# EAGLE design SMS with FM to Genesis (EAGLE 6.5.0)
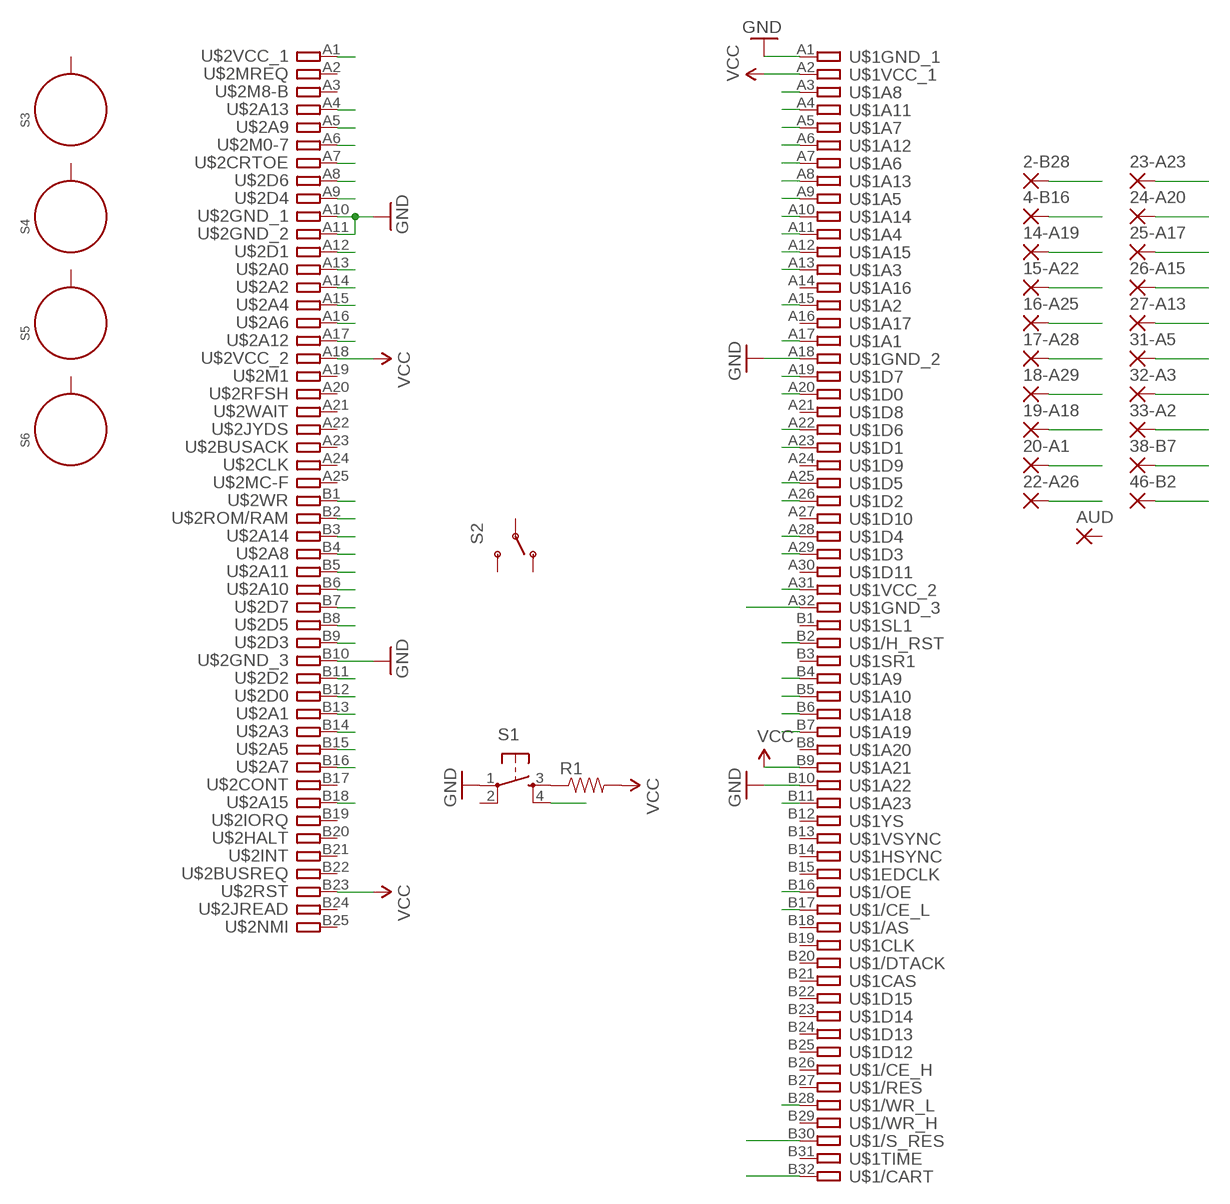
[diagram p0: schematic, sheet 1]

## Parts
2-B28  WIREPADSMD1,27-254  [SMD1,27-2,54]
4-B16  WIREPADSMD1,27-254  [SMD1,27-2,54]
14-A19  WIREPADSMD1,27-254  [SMD1,27-2,54]
15-A22  WIREPADSMD1,27-254  [SMD1,27-2,54]
16-A25  WIREPADSMD1,27-254  [SMD1,27-2,54]
17-A28  WIREPADSMD1,27-254  [SMD1,27-2,54]
18-A29  WIREPADSMD1,27-254  [SMD1,27-2,54]
19-A18  WIREPADSMD1,27-254  [SMD1,27-2,54]
20-A1  WIREPADSMD1,27-254  [SMD1,27-2,54]
22-A26  WIREPADSMD1,27-254  [SMD1,27-2,54]
23-A23  WIREPADSMD1,27-254  [SMD1,27-2,54]
24-A20  WIREPADSMD1,27-254  [SMD1,27-2,54]
25-A17  WIREPADSMD1,27-254  [SMD1,27-2,54]
26-A15  WIREPADSMD1,27-254  [SMD1,27-2,54]
27-A13  WIREPADSMD1,27-254  [SMD1,27-2,54]
31-A5  WIREPADSMD1,27-254  [SMD1,27-2,54]
32-A3  WIREPADSMD1,27-254  [SMD1,27-2,54]
33-A2  WIREPADSMD1,27-254  [SMD1,27-2,54]
38-B7  WIREPADSMD1,27-254  [SMD1,27-2,54]
46-B2  WIREPADSMD1,27-254  [SMD1,27-2,54]
AUD  WIREPADSMD1,27-254  [SMD1,27-2,54]
R1  RESISTOR0805-RES  [0805]
S1  TAC_SWITCHSMD  [TACTILE-SWITCH-SMD]
S2  SWITCH-SPDTPTH  [SWITCH-SPDT]
S3  STANDOFF_ELECTRICAL  [STANDOFF-ELECTRICAL]
S4  STANDOFF_ELECTRICAL  [STANDOFF-ELECTRICAL]
S5  STANDOFF_ELECTRICAL  [STANDOFF-ELECTRICAL]
S6  STANDOFF_ELECTRICAL  [STANDOFF-ELECTRICAL]
U$1  GENESIS-LARGE  [GENESIS-LARGE]
U$2  SMS-R  [SMS]

## Nets
A3: 32-A3.1(P) U$1.A3 U$2.B16
A4: U$1.A4 U$2.B6
A5: 31-A5.1(P) U$1.A5 U$2.A16
A6: U$1.A6 U$2.B5
A7: U$1.A7 U$2.B15
A8: U$1.A8 U$2.A17
A9: U$1.A9 U$2.A15
A10: U$1.A10 U$2.A4
A11: U$1.A11 U$2.B14
A12: U$1.A12 U$2.B3
A13: 27-A13.1(P) U$1.A13 U$2.A14
A15: 26-A15.1(P) U$1.A15 U$2.B13
A17: 25-A17.1(P) U$1.A17 U$2.A13
A19: 14-A19.1(P) U$1.A19 U$2.B7
A20: 24-A20.1(P) U$1.A20 U$2.B12
A22: 15-A22.1(P) U$1.A22 U$2.A8
A23: 23-A23.1(P) U$1.A23 U$2.A12
A25: 16-A25.1(P) U$1.A25 U$2.B8
A26: 22-A26.1(P) U$1.A26 U$2.B11
A28: 17-A28.1(P) U$1.A28 U$2.A9
A29: 18-A29.1(P) U$1.A29 U$2.B9
A31: U$1.A31 U$2.A1
B2: 46-B2.1(P) U$1.B2
B4: U$1.B4 U$2.B4
B5: U$1.B5 U$2.A5
B6: U$1.B6 U$2.A7
B7: 38-B7.1(P) U$1.B7
B11: S1.4 U$1.B11
B16: 4-B16.1(P) U$1.B16 U$2.B2
B17: U$1.B17 U$2.A6 U$2.B18
B28: 2-B28.1(P) U$1.B28 U$2.B1
GND: 19-A18.1(P) 20-A1.1(P) S1.1 U$1.A1 U$1.A18 U$1.B10 U$2.A10 U$2.A11 U$2.B10
N$1: R1.1 S1.3
SMS: U$1.A32 U$1.B30 U$1.B32
VCC: 33-A2.1(P) R1.2 U$1.A2 U$1.B9 U$2.A18 U$2.B23
Unconnected: AUD.1(P) S1.2 S2.1(O) S2.2(P) S2.3(S) S3.P1 S4.P1 S5.P1 S6.P1 U$1.A14 U$1.A16 U$1.A21 U$1.A24 U$1.A27 U$1.A30 U$1.B1 U$1.B3 U$1.B8 U$1.B12 U$1.B13 U$1.B14 U$1.B15 U$1.B18 U$1.B19 U$1.B20 U$1.B21 U$1.B22 U$1.B23 U$1.B24 U$1.B25 U$1.B26 U$1.B27 U$1.B29 U$1.B31 U$2.A2 U$2.A3 U$2.A19 U$2.A20 U$2.A21 U$2.A22 U$2.A23 U$2.A24 U$2.A25 U$2.B17 U$2.B19 U$2.B20 U$2.B21 U$2.B22 U$2.B24 U$2.B25

## Library data of the parts
2-B28 4-B16 14-A19 15-A22 16-A25 17-A28 18-A29 19-A18 20-A1 22-A26 23-A23 24-A20 25-A17 26-A15 27-A13 31-A5 32-A3 33-A2 38-B7 46-B2 AUD = wirepad:WIREPAD: Wire PAD connect wire on PCB
R1 = SparkFun-Passives:RESISTOR: Resistor Basic schematic elements and footprints for 0603, 1206, and PTH resistors.
S1 = SparkFun-Electromechanical:TAC_SWITCH: Momentary Switch Button commonly used for reset or general input. Spark Fun Electronics SKU : COM-00097 SMT- SWCH-08247
S2 = SparkFun-Electromechanical:SWITCH-SPDT: SPDT Switch Simple slide switch, Spark Fun Electronics SKU : COM-00102 DPDT SMT slide switch, AYZ0202, SWCH-08179
S3-S6 = SparkFun-Electromechanical:STANDOFF_ELECTRICAL: A standoff intended to be an electrically connected point. Pad size and stop size allow for a #4 Phillips pan screw head to make a solid connection to the board.
U$1 = genesis:GENESIS: Sega Genesis cartridge connector
U$2 = sms:SMS-R: Sega Master System cartridge connector, reversed

## Board
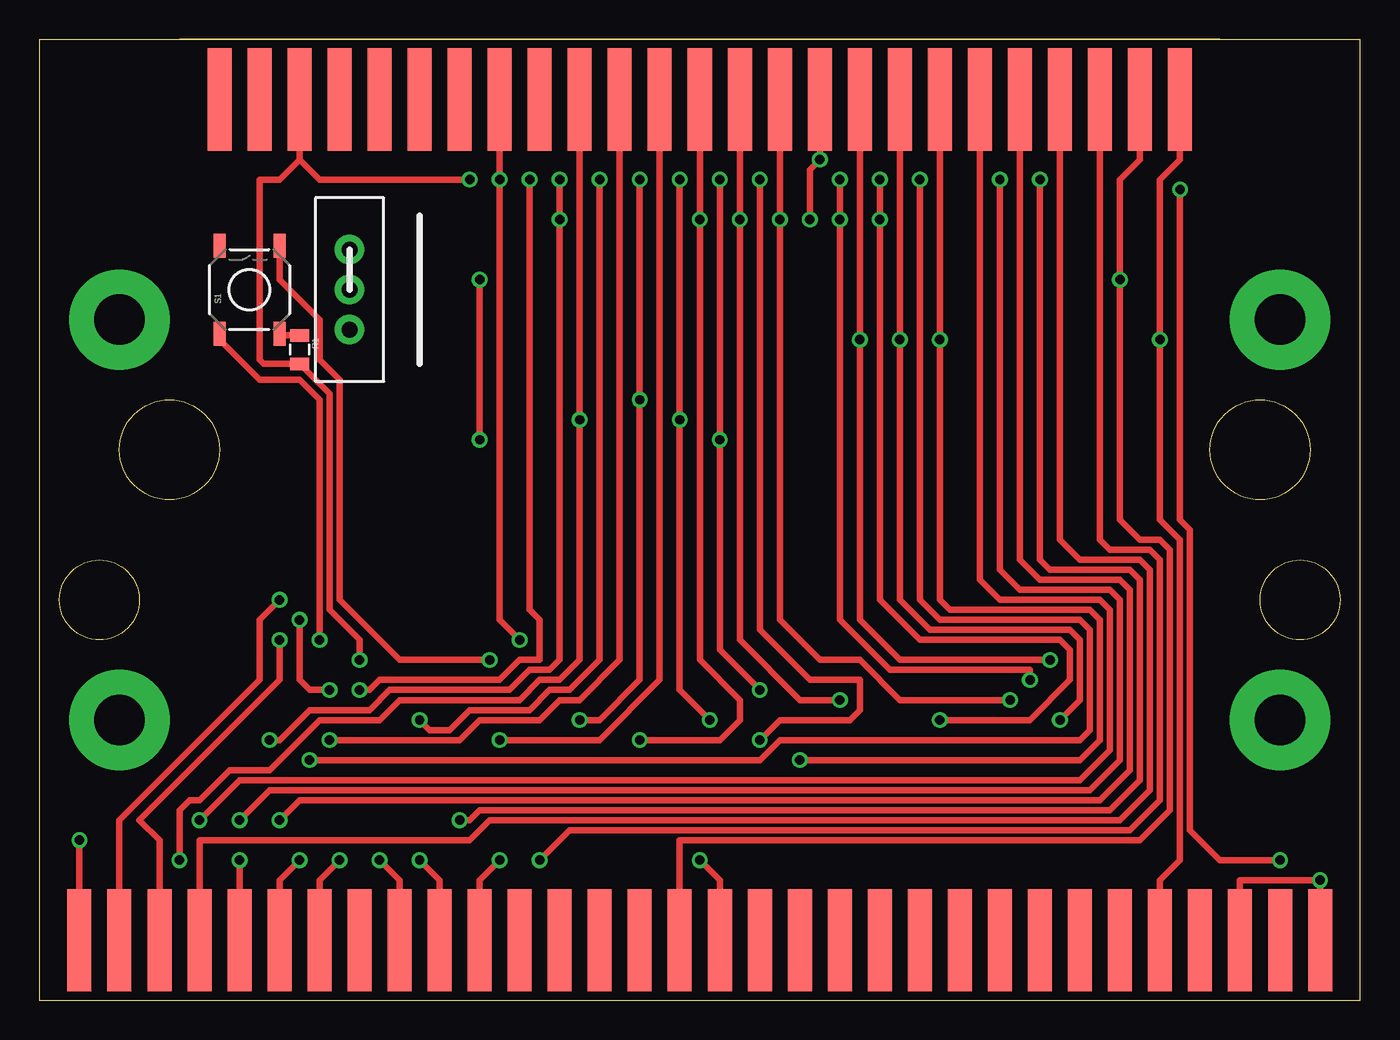
[diagram p1: board, top side]
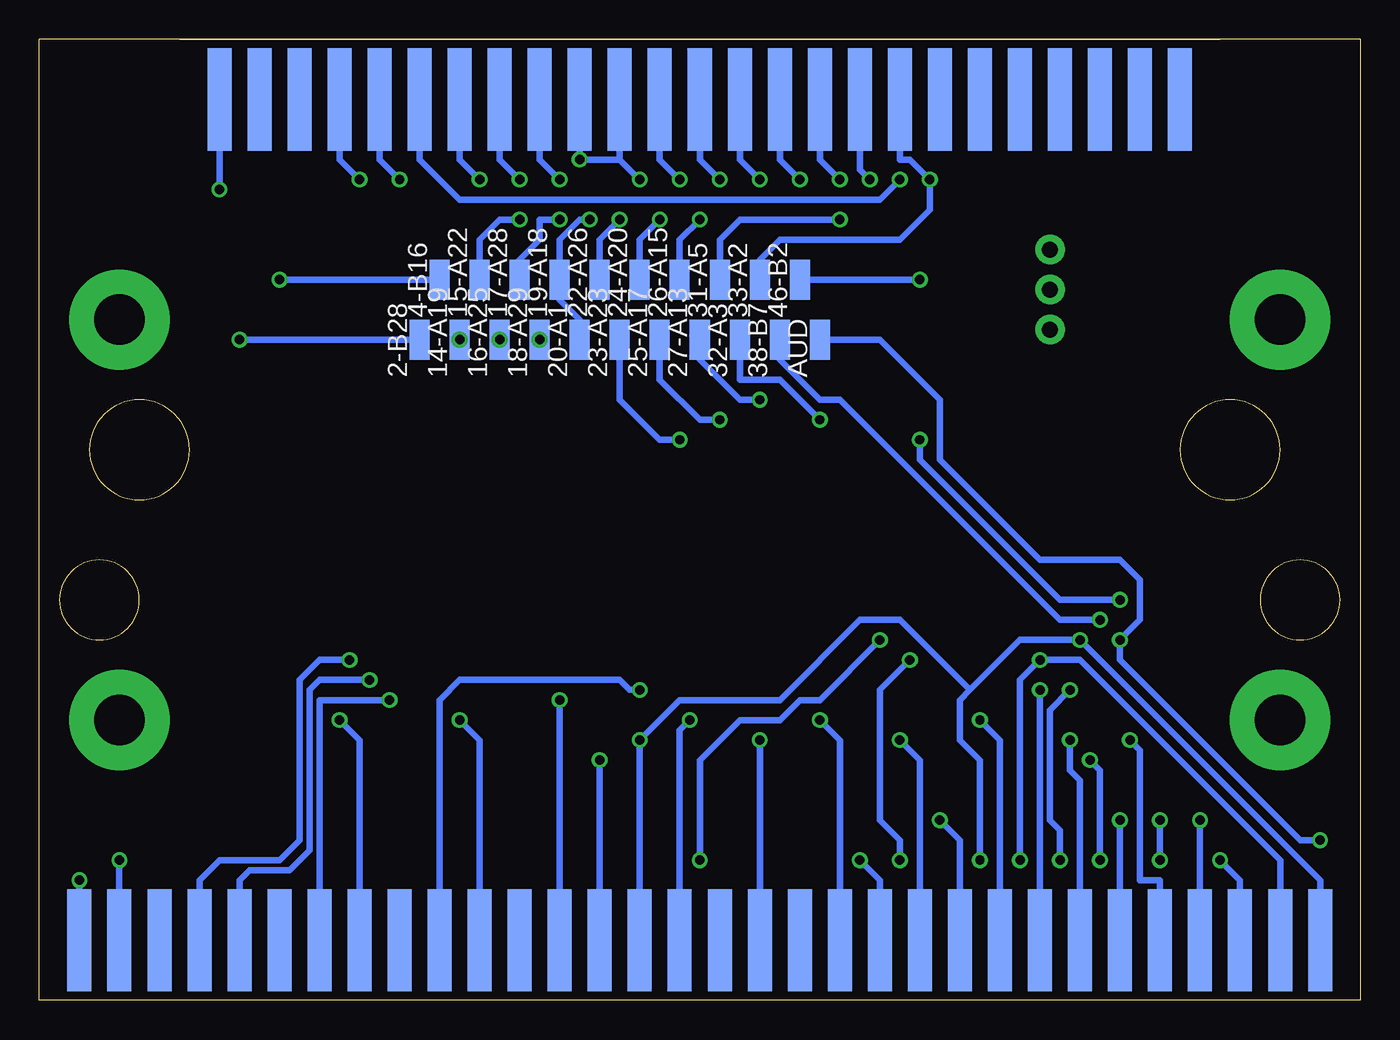
[diagram p2: board, bottom side, seen from below]

Size 83.82 x 60.96 mm. Coordinates in mm from the lower left corner, seen from the top.
Copper layers (1*16): Top 0.035mm / dielectric 1.5mm / Bottom 0.035mm
Design rules "default": minimum track width 10mil, minimum drill 0.6mm, track to track 8mil, track to pad 8mil, pad to pad 8mil, via to via 8mil, smd to smd 8mil, copper to edge 40mil, drill to drill 8mil, minimum pad ring 10mil, minimum via ring 8mil, stop-mask expansion 4mil, vias tented up to drill 0mil, thermal gap 10mil

### Footprints (pad centres in the part's own frame; a part is rotated, then mirrored left to right if it is on the bottom)
SMD1,27-2,54 = smd 1.27 x 2.54: 1 0,0
0805 = smd 0.8 x 1.2: 1 -0.9,0; 2 0.9,0
TACTILE-SWITCH-SMD = smd 1.524 x 0.762: 1 -2.794,1.905; 2 2.794,1.905; 3 -2.794,-1.905; 4 2.794,-1.905
SWITCH-SPDT = drill 1.016 pad 1.88: 1 0,2.54; 2 0,0; 3 0,-2.54
STANDOFF-ELECTRICAL = drill 3.2 pad 6.35: P1 0,0
GENESIS-LARGE = smd 1.524 x 6.477 bottom: A1 2.54,3.81; A2 5.08,3.81; A3 7.62,3.81; A4 10.16,3.81; A5 12.7,3.81; A6 15.24,3.81; A7 17.78,3.81; A8 20.32,3.81; A9 22.86,3.81; A10 25.4,3.81; A11 27.94,3.81; A12 30.48,3.81; A13 33.02,3.81; A14 35.56,3.81; A15 38.1,3.81; A16 40.64,3.81; A17 43.18,3.81; A18 45.72,3.81; A19 48.26,3.81; A20 50.8,3.81; A21 53.34,3.81; A22 55.88,3.81; A23 58.42,3.81; A24 60.96,3.81; A25 63.5,3.81; A26 66.04,3.81; A27 68.58,3.81; A28 71.12,3.81; A29 73.66,3.81; A30 76.2,3.81; A31 78.74,3.81; A32 81.28,3.81 | smd 1.524 x 6.477: B1 2.54,3.81; B2 5.08,3.81; B3 7.62,3.81; B4 10.16,3.81; B5 12.7,3.81; B6 15.24,3.81; B7 17.78,3.81; B8 20.32,3.81; B9 22.86,3.81; B10 25.4,3.81; B11 27.94,3.81; B12 30.48,3.81; B13 33.02,3.81; B14 35.56,3.81; B15 38.1,3.81; B16 40.64,3.81; B17 43.18,3.81; B18 45.72,3.81; B19 48.26,3.81; B20 50.8,3.81; B21 53.34,3.81; B22 55.88,3.81; B23 58.42,3.81; B24 60.96,3.81; B25 63.5,3.81; B26 66.04,3.81; B27 68.58,3.81; B28 71.12,3.81; B29 73.66,3.81; B30 76.2,3.81; B31 78.74,3.81; B32 81.28,3.81
SMS = smd 1.524 x 6.477 bottom: A1 2.54,3.81; A2 5.08,3.81; A3 7.62,3.81; A4 10.16,3.81; A5 12.7,3.81; A6 15.24,3.81; A7 17.78,3.81; A8 20.32,3.81; A9 22.86,3.81; A10 25.4,3.81; A11 27.94,3.81; A12 30.48,3.81; A13 33.02,3.81; A14 35.56,3.81; A15 38.1,3.81; A16 40.64,3.81; A17 43.18,3.81; A18 45.72,3.81; A19 48.26,3.81; A20 50.8,3.81; A21 53.34,3.81; A22 55.88,3.81; A23 58.42,3.81; A24 60.96,3.81; A25 63.5,3.81 | smd 1.524 x 6.477: B1 2.54,3.81; B2 5.08,3.81; B3 7.62,3.81; B4 10.16,3.81; B5 12.7,3.81; B6 15.24,3.81; B7 17.78,3.81; B8 20.32,3.81; B9 22.86,3.81; B10 25.4,3.81; B11 27.94,3.81; B12 30.48,3.81; B13 33.02,3.81; B14 35.56,3.81; B15 38.1,3.81; B16 40.64,3.81; B17 43.18,3.81; B18 45.72,3.81; B19 48.26,3.81; B20 50.8,3.81; B21 53.34,3.81; B22 55.88,3.81; B23 58.42,3.81; B24 60.96,3.81; B25 63.5,3.81

### Placement (x,y rotation side)
2-B28  59.69,41.91 0 bottom
4-B16  58.42,45.72 0 bottom
14-A19  57.15,41.91 0 bottom
15-A22  55.88,45.72 0 bottom
16-A25  54.61,41.91 0 bottom
17-A28  53.34,45.72 0 bottom
18-A29  52.07,41.91 0 bottom
19-A18  50.8,45.72 0 bottom
20-A1  49.53,41.91 0 bottom
22-A26  48.26,45.72 0 bottom
23-A23  46.99,41.91 0 bottom
24-A20  45.72,45.72 0 bottom
25-A17  44.45,41.91 0 bottom
26-A15  43.18,45.72 0 bottom
27-A13  41.91,41.91 0 bottom
31-A5  40.64,45.72 0 bottom
32-A3  39.37,41.91 0 bottom
33-A2  38.1,45.72 0 bottom
38-B7  36.83,41.91 0 bottom
46-B2  35.56,45.72 0 bottom
AUD  34.29,41.91 0 bottom
R1  16.51,41.27 270 top
S1  13.34,45.09 90 top
S2  19.68,45.09 0 top
S3  78.74,43.18 0 top
S4  78.74,17.78 0 top
S5  5.08,43.18 0 top
S6  5.08,17.78 0 top
U$1  0,0 0 top
U$2  74.93,60.96 180 top

### Tracks (layer width: path | path; a pad name or v marks a point on that pad's centre or on a via)
A3  (via drill 0.6)
  Top 0.406: v8.89,8.89 8.89,12.06 9.53,12.7 10.16,12.7 12.06,14.61 14.61,14.61 17.78,17.78 21.59,17.78 22.86,19.05 30.48,19.05 31.75,20.32 33.02,20.32 34.29,21.59 34.29,35.56 v34.29,36.83 U$2.B16
  Bottom 0.406: v8.89,8.89 7.62,7.62 U$1.A3 | 32-A3.1 39.37,39.37 36.83,39.37 v34.29,36.83
A4  (via drill 0.6)
  Top 0.406: v10.16,11.43 12.7,13.97 66.04,13.97 67.94,15.88 67.94,24.77 67.31,25.4 60.96,25.4 59.69,26.67 U$2.B6
  Bottom 0.406: v10.16,11.43 U$1.A4
A5  (via drill 0.6)
  Top 0.406: v14.61,16.51 15.24,16.51 17.14,18.41 20.95,18.41 22.23,19.68 29.84,19.68 31.11,20.95 32.38,20.95 33.02,21.59 33.02,48.26 v33.02,49.53 v33.02,52.07
  Bottom 0.406: U$2.A16 34.29,53.34 v33.02,52.07 | v14.61,16.51 13.97,15.88 13.97,7.62 12.7,7.62 U$1.A5 | 31-A5.1 40.64,48.26 39.37,49.53 v33.02,49.53
A6  (via drill 0.6)
  Top 0.406: U$2.B5 62.23,27.94 63.5,26.67 68.58,26.67 69.22,26.04 69.22,14.61 67.31,12.7 16.51,12.7 v15.24,11.43
  Bottom 0.406: v15.24,11.43 U$1.A6
A7  (via drill 0.6)
  Top 0.406: v18.41,16.51 26.67,16.51 27.94,17.78 31.75,17.78 33.02,19.05 34.29,19.05 36.83,21.59 U$2.B15
  Bottom 0.406: U$1.A7 17.78,13.97 18.41,14.61 v18.41,16.51
A8  (via drill 0.6)
  Top 0.406: v20.32,19.68 20.95,19.68 21.59,20.32 29.21,20.32 30.48,21.59 31.75,21.59 31.75,24.13 31.11,24.77 v31.11,52.07
  Bottom 0.406: U$2.A17 31.75,52.7 v31.11,52.07 | v20.32,19.68 U$1.A8
A9  (via drill 0.6)
  Top 0.406: v24.13,17.78 24.77,17.14 26.04,17.14 27.3,18.41 31.11,18.41 32.38,19.68 33.66,19.68 35.56,21.59 v35.56,52.07
  Bottom 0.406: U$2.A15 36.83,53.34 v35.56,52.07 | v24.13,17.78 22.86,16.51 U$1.A9
A10  (via drill 0.6)
  Top 0.406: v26.67,11.43 27.3,11.43 27.94,12.06 67.94,12.06 69.85,13.97 69.85,26.67 69.22,27.3 64.14,27.3 63.5,27.94 v63.5,52.07
  Bottom 0.406: U$1.A10 25.4,10.16 v26.67,11.43 | v63.5,52.07 64.77,53.34 U$2.A4
A11  (via drill 0.6)
  Top 0.406: v29.21,16.51 35.56,16.51 39.37,20.32 U$2.B14
  Bottom 0.406: v29.21,16.51 27.94,15.24 U$1.A11
A12  (via drill 0.6)
  Top 0.406: v31.75,8.89 33.66,10.79 69.22,10.79 71.12,12.7 71.12,27.94 70.48,28.57 67.94,28.57 67.31,29.21 U$2.B3
  Bottom 0.406: v31.75,8.89 30.48,7.62 U$1.A12
A13  (via drill 0.6)
  Top 0.406: v34.29,17.78 35.56,17.78 38.1,20.32 38.1,36.83 v38.1,38.1 v38.1,52.07
  Bottom 0.406: U$2.A14 39.37,53.34 v38.1,52.07 | v34.29,17.78 33.02,16.51 U$1.A13 | 27-A13.1 41.91,40.64 39.37,38.1 v38.1,38.1
A15  (via drill 0.6)
  Top 0.406: v38.1,16.51 43.18,16.51 44.45,17.78 44.45,19.05 41.91,21.59 41.91,48.26 v41.91,49.53 U$2.B13
  Bottom 0.406: v38.1,16.51 U$1.A15 | 26-A15.1 43.18,48.26 v41.91,49.53
A17  (via drill 0.6)
  Top 0.406: v40.64,52.07 40.64,38.1 v40.64,36.83 40.64,19.68 v42.55,17.78
  Bottom 0.406: U$2.A13 41.91,53.34 v40.64,52.07 | v42.55,17.78 43.18,17.14 U$1.A17 | 25-A17.1 44.45,39.37 41.91,36.83 v40.64,36.83
A19  (via drill 0.6)
  Top 0.406: v48.26,15.24 66.04,15.24 67.31,16.51 67.31,24.13 66.67,24.77 57.78,24.77 57.15,25.4 14-A19.1 U$2.B7
  Bottom 0.406: v48.26,15.24 U$1.A19
  other vias: 57.15,41.91
A20  (via drill 0.6)
  Top 0.406: U$2.B12 v44.45,49.53 44.45,48.26 44.45,22.86 48.26,19.05 v50.8,19.05
  Bottom 0.406: v50.8,19.05 U$1.A20 | 24-A20.1 45.72,48.26 v44.45,49.53
A22  (via drill 0.6)
  Top 0.406: v57.15,17.78 62.87,17.78 65.41,20.32 65.41,22.23 64.77,22.86 55.88,22.86 53.34,25.4 v53.34,49.53 v53.34,52.07
  Bottom 0.406: U$2.A8 54.61,53.34 v53.34,52.07 | v57.15,17.78 55.88,16.51 U$1.A22 | v53.34,49.53 54.61,49.53 55.88,48.26 15-A22.1
A23  (via drill 0.6)
  Top 0.406: v43.18,52.07 43.18,36.83 v43.18,35.56 43.18,22.23 v45.72,19.68
  Bottom 0.406: U$2.A12 44.45,53.34 v43.18,52.07 | U$1.A23 58.42,19.05 57.15,20.32 46.99,20.32 46.35,19.68 v45.72,19.68 | 23-A23.1 46.99,38.1 44.45,35.56 v43.18,35.56
A25  (via drill 0.6)
  Top 0.406: v64.77,17.78 66.04,19.05 66.04,22.86 65.41,23.5 56.52,23.5 54.61,25.4 16-A25.1 U$2.B8
  Bottom 0.406: v64.77,17.78 63.5,16.51 U$1.A25
  other vias: 54.61,41.91
A26  (via drill 0.6)
  Top 0.406: U$2.B11 v46.99,49.53 46.99,24.13 49.53,21.59 52.07,21.59 54.61,19.05 v61.59,19.05
  Bottom 0.406: U$1.A26 66.04,19.05 v61.59,19.05 | 22-A26.1 48.26,48.26 v46.99,49.53
A28  (via drill 0.6)
  Top 0.406: v62.87,20.32 62.87,20.95 53.98,20.95 50.8,24.13 v50.8,49.53 v50.8,52.07
  Bottom 0.406: U$2.A9 52.07,53.34 v50.8,52.07 | U$1.A28 71.12,7.62 70.48,8.26 67.94,8.26 66.67,9.53 66.67,19.68 66.04,20.32 v62.87,20.32 | v50.8,49.53 52.07,49.53 52.07,48.26 53.34,46.99 17-A28.1
A29  (via drill 0.6)
  Top 0.406: U$2.B9 18-A29.1 52.07,24.13 54.61,21.59 v64.14,21.59
  Bottom 0.406: U$1.A29 73.66,7.62 72.39,8.89 68.58,8.89 67.31,10.16 67.31,20.32 66.04,21.59 v64.14,21.59
  other vias: 52.07,41.91
A31  (via drill 0.6)
  Top 0.406: v78.74,8.89 74.93,8.89 73.03,10.79 73.03,29.84 72.39,30.48 v72.39,51.44
  Bottom 0.406: v78.74,8.89 U$1.A31 | v72.39,51.44 U$2.A1
B2  (via drill 0.6)
  Top 0.406: U$1.B2 5.08,11.43 13.97,20.32 13.97,24.13 v15.24,25.4 | v27.94,45.72 v27.94,35.56
  Bottom 0.406: v15.24,25.4 19.05,25.4 27.94,34.29 v27.94,35.56 | 46-B2.1 v27.94,45.72
B4
  Top 0.406: U$1.B4 10.16,10.16 27.3,10.16 28.57,11.43 68.58,11.43 70.48,13.34 70.48,27.3 69.85,27.94 66.04,27.94 64.77,29.21 U$2.B4
B5  (via drill 0.6)
  Top 0.406: v12.7,11.43 14.61,13.34 66.67,13.34 68.58,15.24 68.58,25.4 67.94,26.04 62.23,26.04 60.96,27.3 v60.96,52.07 | v12.7,8.89 U$1.B5
  Bottom 0.406: U$2.A5 62.23,53.34 v60.96,52.07 | v12.7,11.43 v12.7,8.89
B6  (via drill 0.6)
  Top 0.406: v17.14,15.24 45.72,15.24 46.99,16.51 66.04,16.51 66.67,17.14 66.67,23.5 66.04,24.13 57.15,24.13 55.88,25.4 v55.88,52.07 | v16.51,8.89 15.24,7.62 U$1.B6
  Bottom 0.406: U$2.A7 57.15,53.34 v55.88,52.07 | v16.51,8.89 16.51,14.61 v17.14,15.24
B7  (via drill 0.6)
  Top 0.406: U$1.B7 17.78,7.62 v19.05,8.89 | v18.41,19.68 17.14,19.68 16.51,20.32 v16.51,24.13
  Bottom 0.406: v19.05,8.89 19.05,10.79 19.68,11.43 19.68,18.41 v18.41,19.68 | v16.51,24.13 19.05,24.13 33.02,38.1 34.29,38.1 36.83,40.64 38-B7.1
B11  (via drill 0.6)
  Top 0.406: v29.21,8.89 27.94,7.62 U$1.B11 | S1.4 15.24,45.72 17.78,43.18 17.78,40.64 19.05,39.37 19.05,25.4 22.86,21.59 v28.57,21.59
  Bottom 0.406: v28.57,21.59 30.48,19.68 30.48,11.43 29.21,10.16 v29.21,8.89
B16  (via drill 0.6)
  Top 0.406: U$2.B2 69.85,53.34 68.58,52.07 v68.58,45.72 68.58,30.48 69.85,29.21 71.12,29.21 71.75,28.57 71.75,12.06 69.85,10.16 40.64,10.16 U$1.B16
  Bottom 0.406: 4-B16.1 v68.58,45.72
B17  (via drill 0.6)
  Top 0.406: U$1.B17 43.18,7.62 v41.91,8.89 | U$2.B18 v29.21,52.07 29.21,24.13 v30.48,22.86
  Bottom 0.406: v29.21,52.07 30.48,50.8 57.15,50.8 59.69,53.34 U$2.A6 | v41.91,8.89 41.91,15.24 39.37,17.78 36.83,17.78 35.56,19.05 34.29,19.05 v30.48,22.86
B28  (via drill 0.6)
  Top 0.406: U$1.B28 71.12,7.62 72.39,8.89 72.39,29.21 71.12,30.48 v71.12,41.91 71.12,52.07 72.39,53.34 U$2.B1
  Bottom 0.406: 2-B28.1 v71.12,41.91
GND  (via drill 0.6)
  Top 0.406: U$2.B10 v49.53,53.34 48.9,52.7 v48.9,49.53 | v45.72,16.51 46.99,17.78 51.44,17.78 52.07,18.41 52.07,20.32 48.9,20.32 45.72,23.5 v45.72,52.07 | U$1.B10 25.4,7.62 v24.13,8.89 | S1.1 11.43,41.91 13.97,39.37 16.51,39.37 17.78,38.1 v17.78,22.86
  Bottom 0.406: 46.99,53.34 v49.53,53.34 U$2.B10 | U$2.A11 46.99,53.34 | v45.72,52.07 46.99,53.34 | v24.13,8.89 24.13,15.24 25.4,16.51 25.4,19.05 24.77,19.68 | 24.77,19.68 21.59,22.86 v17.78,22.86 2.54,7.62 U$1.A1 | U$1.A18 v45.72,16.51 43.18,19.05 36.83,19.05 31.75,24.13 29.21,24.13 24.77,19.68 | 20-A1.1 49.53,43.18 50.8,44.45 19-A18.1 50.8,48.26 49.53,49.53 v48.9,49.53
N$1
  Top 0.406: R1.1 15.36,42.17 S1.3
N$2  (via drill 0.6)
  Top 0.406: 7.62,5.08 7.62,10.16 6.35,11.43 15.24,20.32 v15.24,22.86 | 2.54,6.35 v2.54,10.16
  Bottom 0.406: v2.54,10.16 3.81,10.16 15.24,21.59 v15.24,22.86 13.97,24.13 13.97,26.67 15.24,27.94 20.32,27.94 26.67,34.29 26.67,38.1 30.48,41.91 34.29,41.91
SMS  (via drill 0.6)
  Top 0.406: U$1.B30 76.2,7.62 v81.28,7.62 U$1.B32
  Bottom 0.406: U$1.B32 v81.28,7.62
VCC  (via drill 0.6)
  Top 0.406: U$2.B23 16.51,53.34 | 16.51,53.34 17.78,52.07 v27.3,52.07 | v21.59,8.89 22.86,7.62 U$1.B9 | 16.51,53.34 15.24,52.07 13.97,52.07 13.97,40.64 14.23,40.38 R1.2 18.41,38.47 18.41,24.77 20.32,22.86 v20.32,21.59
  Bottom 0.406: U$2.A18 29.21,53.34 28.57,53.34 v27.3,52.07 27.3,50.16 29.21,48.26 36.83,48.26 38.1,46.99 33-A2.1 | U$1.A2 5.08,8.89 17.78,21.59 v20.32,21.59 21.59,20.32 v21.59,8.89